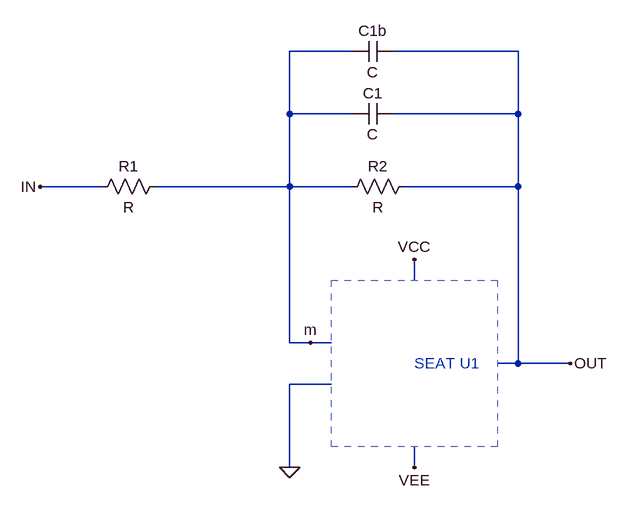
[diagram p0: schematic FO_LP_inv.asc]
FO_LP_inv.asc, the LTspice schematic file:
Version 4.1
SHEET 1 1096 680
WIRE 576 -272 480 -272
WIRE 832 -272 640 -272
WIRE 480 -176 480 -272
WIRE 576 -176 480 -176
WIRE 832 -176 832 -272
WIRE 832 -176 640 -176
WIRE 192 -64 96 -64
WIRE 480 -64 480 -176
WIRE 480 -64 272 -64
WIRE 576 -64 480 -64
WIRE 832 -64 832 -176
WIRE 832 -64 656 -64
WIRE 672 80 672 48
WIRE 480 176 480 -64
WIRE 512 176 480 176
WIRE 544 176 512 176
WIRE 832 208 832 -64
WIRE 832 208 800 208
WIRE 912 208 832 208
WIRE 544 240 480 240
WIRE 480 368 480 240
WIRE 672 368 672 336
FLAG 912 208 OUT
FLAG 672 48 VCC
FLAG 672 368 VEE
FLAG 512 176 m
FLAG 96 -64 IN
FLAG 480 368 0
SYMBOL res 288 -80 R90
WINDOW 0 0 56 VBottom 2
WINDOW 3 32 56 VTop 2
SYMATTR InstName R1
SYMBOL res 672 -80 R90
WINDOW 0 0 56 VBottom 2
WINDOW 3 32 56 VTop 2
SYMATTR InstName R2
SYMBOL cap 640 -288 R90
WINDOW 3 32 32 VTop 2
WINDOW 0 0 32 VBottom 2
SYMATTR InstName C1b
SYMBOL cap 640 -192 R90
WINDOW 0 0 32 VBottom 2
WINDOW 3 32 32 VTop 2
SYMATTR InstName C1
TEXT 672 208 Left 2 ;SEAT U1
RECTANGLE Normal 544 80 800 336 2

The netlist it stands for:
* FO_LP_inv.asc
R1 m IN R
R2 OUT m R
C1b OUT m C
C1 OUT m C
* SEAT U1
.backanno
.end